# Altium project GoodProject.PrjPcb
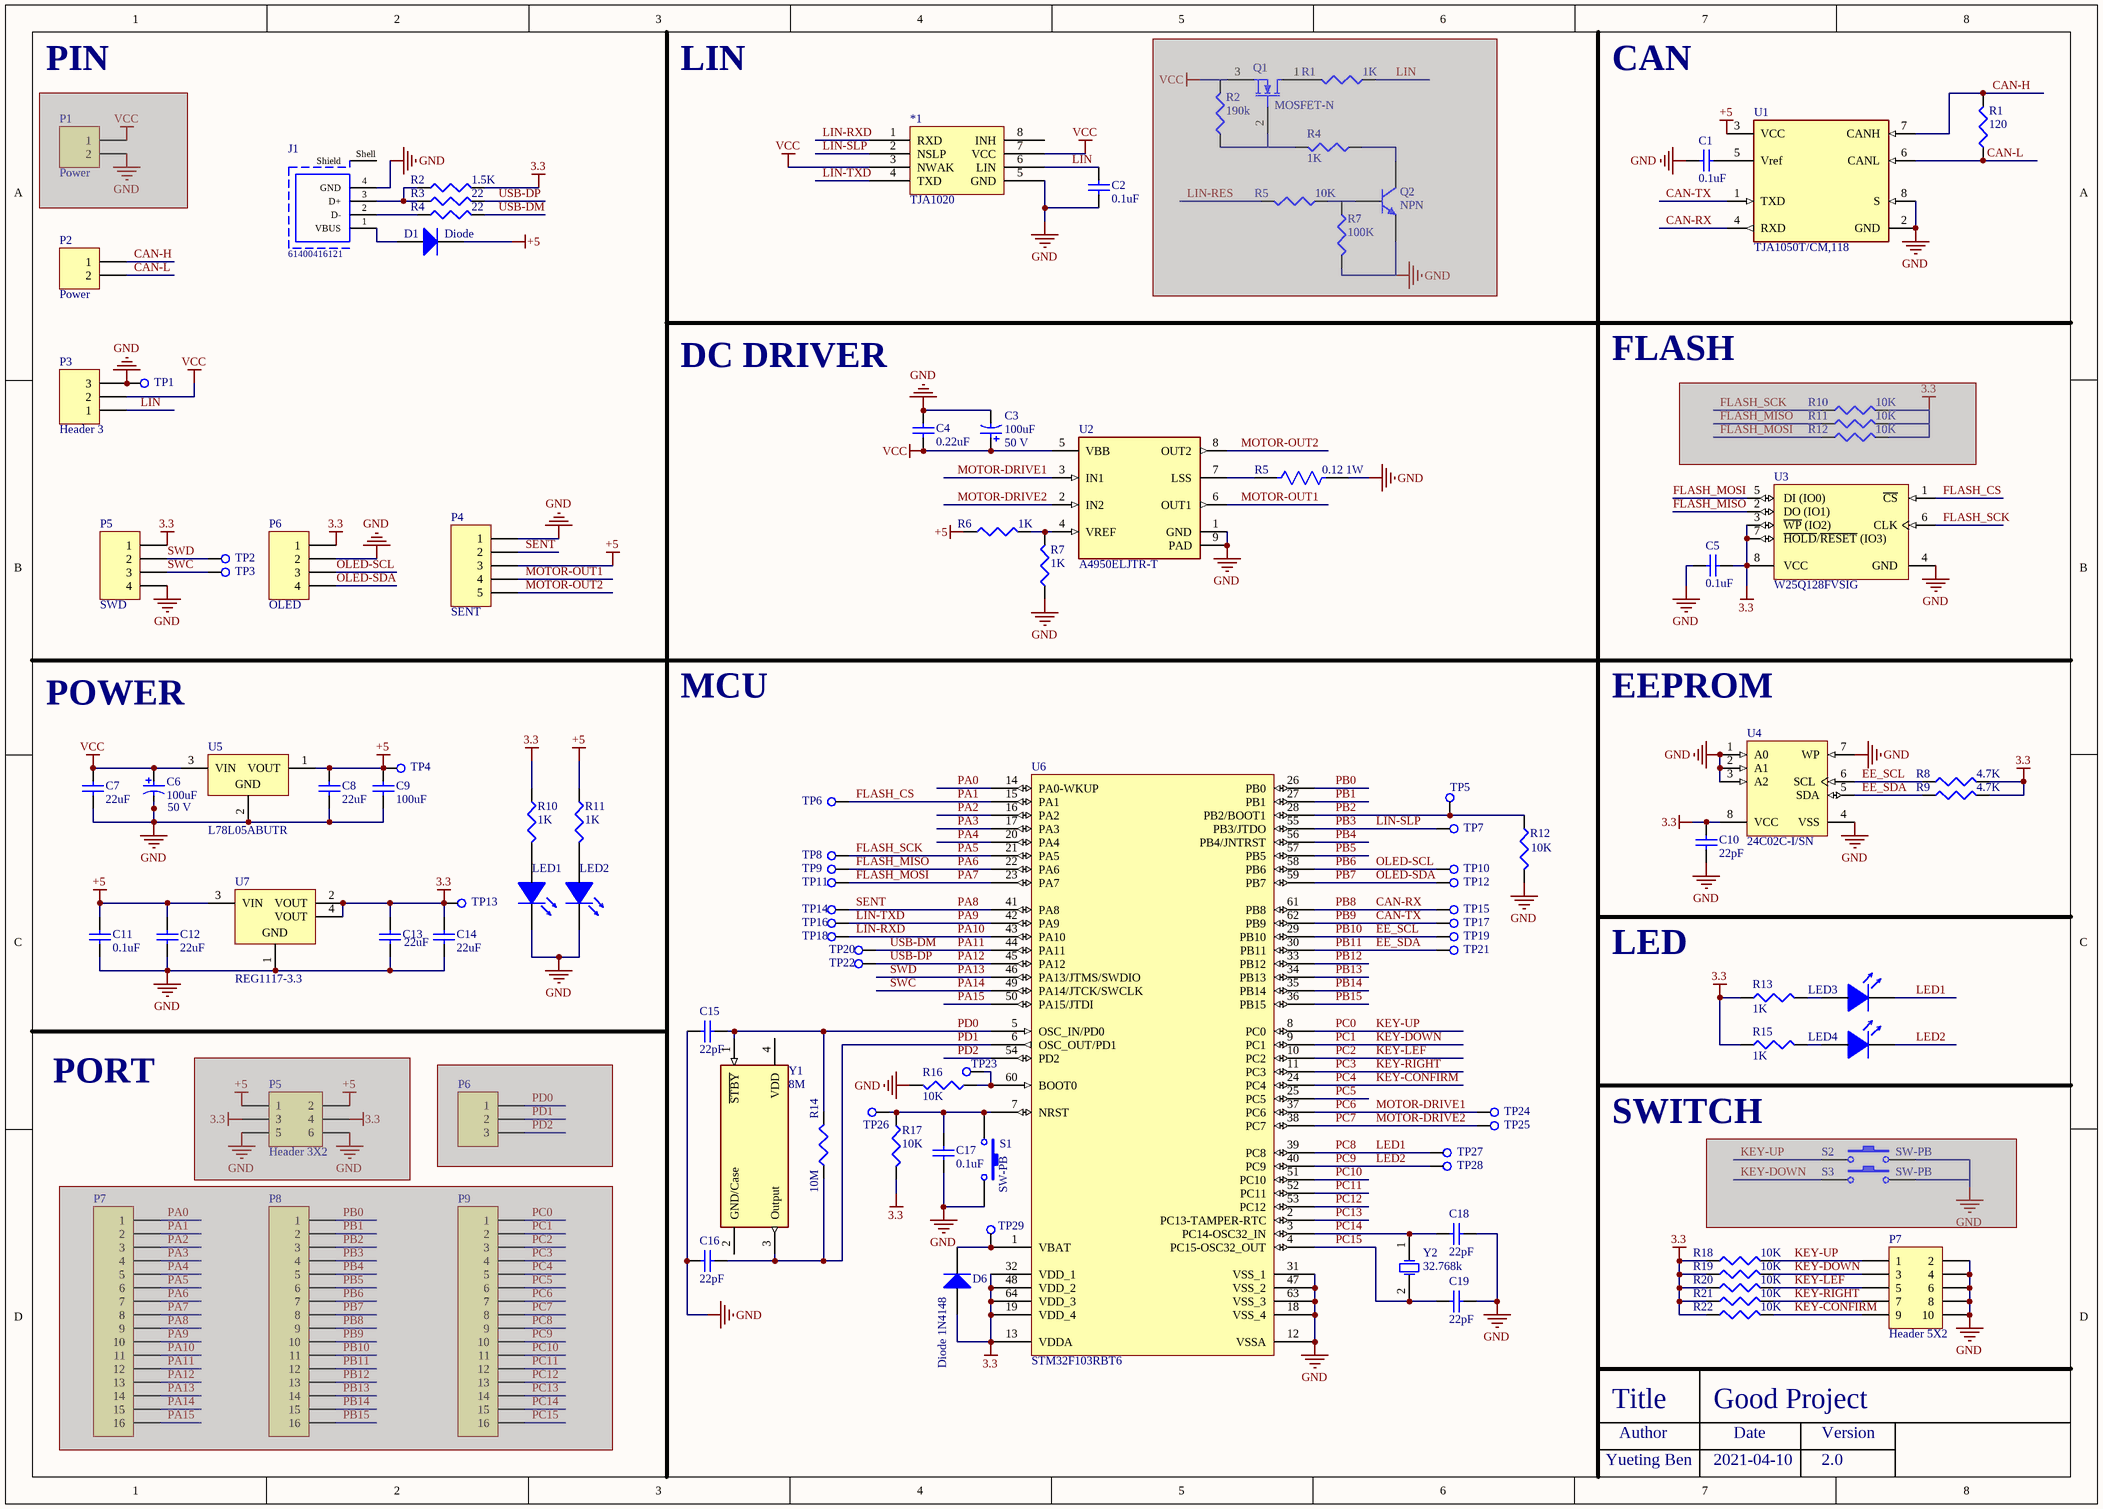
[diagram p0: GoodProject.SchDoc]
1 sheet, 112 parts. Net scope: global (net labels, ports and power ports of the same name join across sheets).
Board files: GoodProject_V1.0.PcbDoc, GoodProject_V2.0.PcbDoc

## Sheet GoodProject.SchDoc: Hello
size A3; Date: 2020-03-12; ApprovedBy: YuetingBen; Author: YuetingBen; Revision: 1.0; SheetNumber: 1; SheetTotal: 1

### Parts
(Parts that share a designator on the sheet are numbered #1, #2 ... from top to bottom, then left to right.)
*1  TJA1020  [SOP127P600X175-8N]
C1  value 0.1uF  [1608[0603]]  (hidden comment: Cap)
C2  value 0.1uF  [1608[0603]]  (hidden comment: Cap)
C3  100uF  Rated Voltage: 50 V  [NIC-CAPA2-6.3X5.8_V]
C4  value 0.22uF  [1608[0603]]  (hidden comment: Cap)
C5  value 0.1uF  [1608[0603]]  (hidden comment: Cap)
C6  100uF  Rated Voltage: 50 V  [NIC-CAPA2-6.3X5.8_V]
C7  value 22uF  [1608[0603]]  (hidden comment: Cap)
C8  value 22uF  [1608[0603]]  (hidden comment: Cap)
C9  value 100uF  [C1206]  (hidden comment: Cap)
C10  value 22pF  [1608[0603]]  (hidden comment: Cap)
C11  value 0.1uF  [1608[0603]]  (hidden comment: Cap)
C12  value 22uF  [1608[0603]]  (hidden comment: Cap)
C13  value 22uF  [1608[0603]]  (hidden comment: Cap)
C14  value 22uF  [C1206]  (hidden comment: Cap)
C15  value 22pF  [1608[0603]]  (hidden comment: Cap)
C16  value 22pF  [1608[0603]]  (hidden comment: Cap)
C17  value 0.1uF  [1608[0603]]  (hidden comment: Cap)
C18  value 22pF  [1608[0603]]  (hidden comment: Cap)
C19  value 22pF  [1608[0603]]  (hidden comment: Cap)
D1  Diode  [SMB]
D6  Diode 1N4148  [SMB]
J1  61400416121  [61400416121]
LED1  LED  [led3mm]  (value not drawn)
LED2  LED  [led3mm]  (value not drawn)
LED3  LED  [led3mm]  (value not drawn)
LED4  LED  [led3mm]  (value not drawn)
P1  Power  [PIN2]  (masked out: inside a compile mask, not in the netlist)
P2  Power  [PIN2]
P3  Header 3  [HDR1X3]
P4  SENT  [HDR1X5]
P5#1  SWD  [HDR1X4]
P5#2  Header 3X2  [HDR2X3]  (masked out: inside a compile mask, not in the netlist)
P6#1  OLED  [HDR1X4]
P6#2  Header 3  [HDR1X3]  (value not drawn)  (masked out: inside a compile mask, not in the netlist)
P7#1  Header 16  [HDR1X16]  (value not drawn)  (masked out: inside a compile mask, not in the netlist)
P7#2  Header 5X2  [HDR2X5]
P8  Header 16  [HDR1X16]  (value not drawn)  (masked out: inside a compile mask, not in the netlist)
P9  Header 16  [HDR1X16]  (value not drawn)  (masked out: inside a compile mask, not in the netlist)
Q1  MOSFET-N  [SOT23_N]  (masked out: inside a compile mask, not in the netlist)
Q2  NPN  [SOT23_N]  (masked out: inside a compile mask, not in the netlist)
R1#1  value 1K  [14-1210]  (hidden comment: Res3)  (masked out: inside a compile mask, not in the netlist)
R1#2  value 120  [J1-0603]  (hidden comment: Res3)
R2#1  value 190k  [J1-0603]  (hidden comment: Res3)  (masked out: inside a compile mask, not in the netlist)
R2#2  value 1.5K  [J1-0603]  (hidden comment: Res3)
R3  value 22  [J1-0603]  (hidden comment: Res3)
R4#1  value 1K  [J1-0603]  (hidden comment: Res3)  (masked out: inside a compile mask, not in the netlist)
R4#2  value 22  [J1-0603]  (hidden comment: Res3)
R5#1  value 10K  [J1-0603]  (hidden comment: Res3)  (masked out: inside a compile mask, not in the netlist)
R5#2  0.12 1W  [FP-CRCW2512-e3-IPC_C]
R6  value 1K  [J1-0603]  (hidden comment: Res3)
R7#1  value 100K  [J1-0603]  (hidden comment: Res3)  (masked out: inside a compile mask, not in the netlist)
R7#2  value 1K  [J1-0603]  (hidden comment: Res3)
R8  value 4.7K  [J1-0603]  (hidden comment: Res3)
R9  value 4.7K  [J1-0603]  (hidden comment: Res3)
R10#1  value 10K  [J1-0603]  (hidden comment: Res3)  (masked out: inside a compile mask, not in the netlist)
R10#2  value 1K  [J1-0603]  (hidden comment: Res3)
R11#1  value 10K  [J1-0603]  (hidden comment: Res3)  (masked out: inside a compile mask, not in the netlist)
R11#2  value 1K  [J1-0603]  (hidden comment: Res3)
R12#1  value 10K  [J1-0603]  (hidden comment: Res3)  (masked out: inside a compile mask, not in the netlist)
R12#2  value 10K  [J1-0603]  (hidden comment: Res3)
R13  value 1K  [J1-0603]  (hidden comment: Res3)
R14  value 10M  [J1-0603]  (hidden comment: Res3)
R15  value 1K  [J1-0603]  (hidden comment: Res3)
R16  value 10K  [J1-0603]  (hidden comment: Res3)
R17  value 10K  [J1-0603]  (hidden comment: Res3)
R18  value 10K  [J1-0603]  (hidden comment: Res3)
R19  value 10K  [J1-0603]  (hidden comment: Res3)
R20  value 10K  [J1-0603]  (hidden comment: Res3)
R21  value 10K  [J1-0603]  (hidden comment: Res3)
R22  value 10K  [J1-0603]  (hidden comment: Res3)
S1  SW-PB  [12Z-2010]
S2  SW-PB  [12Z-2010]  (masked out: inside a compile mask, not in the netlist)
S3  SW-PB  [12Z-2010]  (masked out: inside a compile mask, not in the netlist)
TP1  TestPoint*  [TestPoint]  (value not drawn)
TP2  TestPoint*  [TestPoint]  (value not drawn)
TP3  TestPoint*  [TestPoint]  (value not drawn)
TP4  TestPoint*  [TestPoint]  (value not drawn)
TP5  TestPoint*  [TestPoint]  (value not drawn)
TP6  TestPoint*  [TestPoint]  (value not drawn)
TP7  TestPoint*  [TestPoint]  (value not drawn)
TP8  TestPoint*  [TestPoint]  (value not drawn)
TP9  TestPoint*  [TestPoint]  (value not drawn)
TP10  TestPoint*  [TestPoint]  (value not drawn)
TP11  TestPoint*  [TestPoint]  (value not drawn)
TP12  TestPoint*  [TestPoint]  (value not drawn)
TP13  TestPoint*  [TestPoint]  (value not drawn)
TP14  TestPoint*  [TestPoint]  (value not drawn)
TP15  TestPoint*  [TestPoint]  (value not drawn)
TP16  TestPoint*  [TestPoint]  (value not drawn)
TP17  TestPoint*  [TestPoint]  (value not drawn)
TP18  TestPoint*  [TestPoint]  (value not drawn)
TP19  TestPoint*  [TestPoint]  (value not drawn)
TP20  TestPoint*  [TestPoint]  (value not drawn)
TP21  TestPoint*  [TestPoint]  (value not drawn)
TP22  TestPoint*  [TestPoint]  (value not drawn)
TP23  TestPoint*  [TestPoint]  (value not drawn)
TP24  TestPoint*  [TestPoint]  (value not drawn)
TP25  TestPoint*  [TestPoint]  (value not drawn)
TP26  TestPoint*  [TestPoint]  (value not drawn)
TP27  TestPoint*  [TestPoint]  (value not drawn)
TP28  TestPoint*  [TestPoint]  (value not drawn)
TP29  TestPoint*  [TestPoint]  (value not drawn)
U1  TJA1050T/CM,118  [FP-SOT96-1-IPC_A]
U2  A4950ELJTR-T  [FP-LJ-8-MFG]
U3  W25Q128FVSIG  [WINB-SOIC-8_M]
U4  24C02C-I/SN  [SOIC-SN8_L]
U5  L78L05ABUTR  [SOT-89_N]
U6  STM32F103RBT6  [LQFP64_N]
U7  REG1117-3.3  [DCY0004A_M]
Y1  8M  [FP-ASE-MFG]
Y2  32.768k  [C1206]

### Nets
3.3: C5.1 C10.2 C13.2 C14.2 D6.1(A) P5#1.1 P6#1.1 R2#2.2 R8.2 R9.2 R10#2.1 R13.1 R15.1 R17.2 R18.1 R19.1 R20.1 R21.1 R22.1 TP13.1 U3.3(~{WP}_(IO2)) U3.7(~{HOLD}/~{RESET}_(IO3)) U3.8(VCC) U4.8(VCC) U6.13(VDDA) U6.19(VDD_4) U6.32(VDD_1) U6.48(VDD_2) U6.64(VDD_3) U7.2(VOUT) U7.4(VOUT)
+5: C8.2 C9.2 C11.2 C12.2 D1.2(K) P4.3 R6.1 R11#2.1 TP4.1 U1.3(VCC) U5.1(VOUT) U7.3(VIN)
GND: *1.5(GND) C1.2 C2.1 C3.2 C4.1 C5.2 C6.2 C7.1 C8.1 C9.1 C10.1 C11.1 C12.1 C13.1 C14.1 C15.2 C16.2 C17.1 C18.1 C19.1 J1.4(GND) LED1.2 LED2.2 P3.3 P4.1 P5#1.4 P6#1.2 P7#2.2 P7#2.4 P7#2.6 P7#2.8 P7#2.10 R5#2.2 R7#2.1 R12#2.2 R16.2 S1.2 TP1.1 U1.2(GND) U1.8(S) U2.1(GND) U2.9(PAD) U3.4(GND) U4.1(A0) U4.2(A1) U4.3(A2) U4.4(VSS) U4.7(WP) U5.2(GND) U6.12(VSSA) U6.18(VSS_4) U6.31(VSS_1) U6.47(VSS_2) U6.63(VSS_3) U7.1(GND)
VCC: *1.3(NWAK) *1.7(VCC) C3.1 C4.2 C6.1 C7.2 P3.2 U2.5(VBB) U5.3(VIN)
CAN-H: P2.1 R1#2.2 U1.7(CANH)
CAN-L: P2.2 R1#2.1 U1.6(CANL)
CAN-RX: TP15.1 U1.4(RXD) U6.61(PB8)  [also labelled PB8]
CAN-TX: TP17.1 U1.1(TXD) U6.62(PB9)  [also labelled PB9]
EE_SCL: R8.1 TP19.1 U4.6(SCL) U6.29(PB10)  [also labelled PB10]
EE_SDA: R9.1 TP21.1 U4.5(SDA) U6.30(PB11)  [also labelled PB11]
FLASH_CS: TP6.1 U3.1(~{CS}) U6.15(PA1)  [also labelled PA1]
FLASH_MISO: TP9.1 U3.2(DO_(IO1)) U6.22(PA6)  [also labelled PA6]
FLASH_MOSI: TP11.1 U3.5(DI_(IO0)) U6.23(PA7)  [also labelled PA7]
FLASH_SCK: TP8.1 U3.6(CLK) U6.21(PA5)  [also labelled PA5]
KEY-CONFIRM: P7#2.9 R22.2 U6.24(PC4)  [also labelled PC4]
KEY-DOWN: P7#2.3 R19.2 U6.9(PC1)  [also labelled PC1]
KEY-LEF: P7#2.5 R20.2 U6.10(PC2)  [also labelled PC2]
KEY-RIGHT: P7#2.7 R21.2 U6.11(PC3)  [also labelled PC3]
KEY-UP: P7#2.1 R18.2 U6.8(PC0)  [also labelled PC0]
LED1: LED3.2 TP27.1 U6.39(PC8)  [also labelled PC8]
LED2: LED4.2 TP28.1 U6.40(PC9)  [also labelled PC9]
LIN: *1.6(LIN) C2.2 P3.1
LIN-RXD: *1.1(RXD) TP18.1 U6.43(PA10)  [also labelled PA10]
LIN-SLP: *1.2(NSLP) TP7.1 U6.55(PB3/JTDO)  [also labelled PB3]
LIN-TXD: *1.4(TXD) TP16.1 U6.42(PA9)  [also labelled PA9]
MOTOR-DRIVE1: TP24.1 U2.3(IN1) U6.37(PC6)  [also labelled PC6]
MOTOR-DRIVE2: TP25.1 U2.2(IN2) U6.38(PC7)  [also labelled PC7]
MOTOR-OUT1: P4.4 U2.6(OUT1)
MOTOR-OUT2: P4.5 U2.8(OUT2)
OLED-SCL: P6#1.3 TP10.1 U6.58(PB6)  [also labelled PB6]
OLED-SDA: P6#1.4 TP12.1 U6.59(PB7)  [also labelled PB7]
PA0: U6.14(PA0-WKUP)
PA2: U6.16(PA2)
PA3: U6.17(PA3)
PA4: U6.20(PA4)
PA8: P4.2 TP14.1 U6.41(PA8)  [also labelled SENT]
PA11: R4#2.2 TP20.1 U6.44(PA11)  [also labelled USB-DM]
PA12: R3.2 TP22.1 U6.45(PA12)  [also labelled USB-DP]
PA13: P5#1.2 TP2.1 U6.46(PA13/JTMS/SWDIO)  [also labelled SWD]
PA14: P5#1.3 TP3.1 U6.49(PA14/JTCK/SWCLK)  [also labelled SWC]
PA15: U6.50(PA15/JTDI)
PB0: U6.26(PB0)
PB1: U6.27(PB1)
PB2: R12#2.1 TP5.1 U6.28(PB2/BOOT1)
PB4: U6.56(PB4/JNTRST)
PB5: U6.57(PB5)
PB12: U6.33(PB12)
PB13: U6.34(PB13)
PB14: U6.35(PB14)
PB15: U6.36(PB15)
PC5: U6.25(PC5)
PC10: U6.51(PC10)
PC11: U6.52(PC11)
PC12: U6.53(PC12)
PC13: U6.2(PC13-TAMPER-RTC)
PC14: C18.2 U6.3(PC14-OSC32_IN) Y2.1(OSC1)
PC15: C19.2 U6.4(PC15-OSC32_OUT) Y2.2(OSC2)
PD0: C15.1 R14.2 U6.5(OSC_IN/PD0) Y1.1(~{STBY})
PD1: C16.1 R14.1 U6.6(OSC_OUT/PD1) Y1.3(Output)
PD2: U6.54(PD2)
NetC1_1: C1.1 U1.5(Vref)
NetC17_2: C17.2 R17.1 S1.1 TP26.1 U6.7(NRST)
NetD1_1: D1.1(A) J1.1(VBUS)
NetD6_2: D6.2(K) TP29.1 U6.1(VBAT)
NetJ1_2: J1.2(D-) R4#2.1
NetJ1_3: J1.3(D+) R2#2.1 R3.1
NetLED1_1: LED1.1 R10#2.2
NetLED2_1: LED2.1 R11#2.2
NetLED3_1: LED3.1 R13.2
NetLED4_1: LED4.1 R15.2
NetR5#2_1: R5#2.1 U2.7(LSS)
NetR6_2: R6.2 R7#2.2 U2.4(VREF)
NetR16_1: R16.1 TP23.1 U6.60(BOOT0)

Not connected (* = marked no-connect by the designer): *1 8(INH); J1 Shell(Shield); Y1 2(GND/Case) 4(VDD)

### Notes on the sheet
- PIN
- LIN
- CAN
- DC DRIVER
- FLASH
- POWER
- MCU
- (near U4) EEPROM
- LED
- PORT
- SWITCH
- Title
- Author
- Good Project
- Date
- Version
- Yueting Ben
- 2021-04-10
- 2.0

### Library data of the parts
C1 C2 C4 C5 C7-C19 = Cap: Capacitor; Published: 8-Jun-2000; LatestRevisionDate: 17-Jul-2002; LatestRevisionNote: Re-released for DXP Platform.; PackageReference: RAD-0.3; Publisher: Altium Limited; PackageDescription: Radial Cap, Thru-Hole; 2 Leads; 0.3 in Pin Spacing
C3 C6 = CMP-0687-00035-1: Aluminum Electrolytic Capacitor, UD Series, Low Impedance, 68 uF, 16 V, + / - 20%, -55 to 105 degC, Chip Type, 6.3 x 5.8 mm D x L, Pb-Free, Reel; PartNumber: UUD1C680MCL1GS; Manufacturer: Nichicon; Endurance Time: 2000 h; Rated Ripple Current (at 100kHz): 230 mA; Rated Capacitance: 68 uF; Impedance: 0.44 Ohm; Packing: Dia382mm Reel; Tolerance Rated Capacitance: -20 to 20%; ComponentLink2URL: http://products.nichicon.co.jp/en/pdf/XJA043/e-ud.pdf; RoHS: TRUE; ComponentLink2Description: Datasheet; ComponentLink1Description: Manufacturer URL; PackageReference: CAPAE-D6.3H5.8; ComponentLink1URL: http://www.nichicon.co.jp/; ComponentLink3URL: http://products.nichicon.co.jp/en/pdf/XJA043/e-ud.pdf; ComponentLink3Description: Package Specification; Length: 5.8 mm; DatasheetVersion: 08/2012; PackageDescription: 2-Pin Surface Mount Device, Diameter 6.3 mm, Height 5.8 mm, Pitch 5.4 mm; Diameter: 6.3 mm; Mounting Technology: Surface Mount
D1 = Diode: Default Diode; Published: 8-Jun-2000; LatestRevisionDate: 17-Jul-2002; LatestRevisionNote: Re-released for DXP Platform.; PackageVersion: Sep-1996; PackageReference: SMC; Publisher: Altium Limited; PackageDescription: DO-214-AB/SMC; 2 C-Bend Leads; Body 7.9 x 5.9 mm, inc. leads (LxW); Code_JEDEC: DO-214-AB
D6 = Diode 1N4148: High Conductance Fast Diode; Published: 8-Jun-2000; LatestRevisionDate: 17-Jul-2002; LatestRevisionNote: Re-released for DXP Platform.; DatasheetVersion: 1997; PackageReference: DO-35; Publisher: Altium Limited; PackageDescription: Diode, Axial; Body 3.8 x 1.9 mm (LxDia. max), Lead Dia. 0.53 mm (max); Code_JEDEC: DO-204-AH; ComponentLink1Description: Manufacturer Link; ComponentLink1URL: http://www.fairchildsemi.com/; ComponentLink2Description: Datasheet; ComponentLink2URL: http://www.fairchildsemi.com/ds/1N%2F1N4148.pdf
J1 = CMP-1502-03243-1: USB 2.0 Type B Receptacle WR-COM, Horizontal, THT, with Pads and Pegs; Manufacturer: Wurth Elektronik; Contact Resistance: 20mOhm; Rated Current: 1.5A; Working Voltage: 30VAC; Package Reference: 61400416121; Part Number: 61400416121; Packaging: Tray; Mounting Technology: THT; Gender: Receptacle; Datasheet URL: https://katalog.we-online.de/em/datasheet/61400416121.pdf; Publisher: WurthElektronik; Orientation: Horizontal; Connector Type: USB2.0TypeB; Operating Temperature: -40to105degC; Manufacturer URL: http://www.we-online.de
P1 P2 = Header 2H: Header, 2-Pin, Right Angle; LatestRevisionDate: 17-Jul-2002; LatestRevisionNote: Re-released for DXP Platform.; Publisher: Altium Limited
P3 P6#2 = Header 3: Header, 3-Pin; LatestRevisionDate: 17-Jul-2002; LatestRevisionNote: Re-released for DXP Platform.; Publisher: Altium Limited
P4 = Header 5: Header, 5-Pin; LatestRevisionDate: 17-Jul-2002; LatestRevisionNote: Re-released for DXP Platform.; Publisher: Altium Limited
P5#1 P6#1 = Header 4: Header, 4-Pin; LatestRevisionDate: 17-Jul-2002; LatestRevisionNote: Re-released for DXP Platform.; Publisher: Altium Limited
P5#2 = Header 3X2: Header, 3-Pin, Dual row; LatestRevisionDate: 17-Jul-2002; LatestRevisionNote: Re-released for DXP Platform.; Publisher: Altium Limited
P7#1 P8 P9 = Header 16: Header, 16-Pin; LatestRevisionDate: 17-Jul-2002; LatestRevisionNote: Re-released for DXP Platform.; Publisher: Altium Limited
P7#2 = Header 5X2: Header, 5-Pin, Dual row; LatestRevisionDate: 17-Jul-2002; LatestRevisionNote: Re-released for DXP Platform.; Publisher: Altium Limited
Q1 = MOSFET-N: N-Channel MOSFET; Published: 8-Jun-2000; LatestRevisionDate: 17-Jul-2002; LatestRevisionNote: Re-released for DXP Platform.; PackageVersion: 1995/1996; PackageReference: E3; Publisher: Altium Limited; PackageDescription: TO, Flat Index; 3 In-Line, Axial Leads; Body Dia. 4.6mm; Lead Dia. 0.5 mm (max)
Q2 = NPN: NPN Bipolar Transistor; Published: 8-Jun-2000; LatestRevisionDate: 17-Jul-2002; LatestRevisionNote: Re-released for DXP Platform.; PackageReference: TO-226-AA; Publisher: Altium Limited; PackageDescription: TO, Flat Index; 3 In-Line, Axial Leads; Body Dia. 4.8mm; Leads 0.55 x 0.51 mm (max); Code_JEDEC: TO-226-AA
R1#1 R1#2 R2#1 R2#2 R3 R4#1 R4#2 R5#1 R6 R7#1 R7#2 R8 R9 R10#1 R10#2 R11#1 R11#2 R12#1 R12#2 R13-R22 = Res3: Resistor; Published: 8-Jun-2000; LatestRevisionDate: 29-May-2009; LatestRevisionNote: IPC-7351 Footprint Added.; PackageReference: J1-0603; Publisher: Altium Limited; PackageDescription: Chip Resistor
R5#2 = CMP-02407-006956-1: RES Thick Film, 1Ω, 1%, 1W, 100ppm/°C, 2512; Resistance: 1R; Voltage Rating: 500V; Number of Terminations: 2; Packaging: Tape and Reel; Features: Automotive AEC-Q200; Military Standard: Not; Power Rating: 1W; Max Operating Temperature: 155°C; Number of Pins: 2; Radiation Hardening: No; Mount: Surface Mount; Height: 0.6mm; Max Power Dissipation: 1W; Case Code (Metric): 6432; Termination: SMD/SMT; REACH SVHC: No SVHC; Case/Package: 2512; Weight: 0.001429oz; Tolerance: 1%; Package Quantity: 2000; Composition: Thick Film; Temperature Coefficient: 100ppm/°C; Voltage Rating (DC): 500V; Width: 0.124inch; Length: 6.3mm; Lead Free: Lead Free; Min Operating Temperature: -55°C; Contact Plating: Tin; Case Code (Imperial): 2512; Depth: 3.15mm
S1-S3 = SW-PB: Switch; Published: 24-Mar-1999; LatestRevisionDate: 17-Jul-2002; LatestRevisionNote: Re-released for DXP Platform.; PackageReference: SPST-2; Publisher: Altium Limited; PackageDescription: Switch; 2 Leads
TP1-TP29 = TP
U1 = CMP-2000-04923-2: IC TRANSCEIVER HALF 1/1 8SO; Simplex/Duplex: Half Duplex; Max Supply Current: 10mA; Number of Receive Buffers: 1; Min Supply Voltage: 4.75V; Max Supply Voltage: 5.25V; Interface: CAN; Data Rate: 1Mbps; Receiver Hysteresis: 70mV; Number of Transmit Buffers: 1; Min Operating Temperature: -40°C; Case/Package: SO; REACH SVHC: No SVHC; Max Operating Temperature: 150°C; Number of Pins: 8; Lead Free: Lead Free; Number of Transceivers: 1; Packaging: Tape and Reel; Mount: Surface Mount; Radiation Hardening: No; Nominal Supply Current: 10mA; Package Quantity: 2500; Contact Plating: Gold
U2 = CMP-82903-000003-1: IC MOTOR DRIVER 8V-40V 8SOIC; Output Current: 3.5A; Number of Outputs: 1; Min Supply Voltage: 8V; Collector Emitter Voltage (VCEO): 40V; Motor Type: Brushed; Number of Pins: 8; Case/Package: SOIC; Height: 1.55mm; Package Quantity: 1; Mount: Surface Mount; Max Operating Temperature: 85°C; Min Operating Temperature: -40°C; REACH SVHC: No SVHC; Radiation Hardening: No; Length: 4.9mm; Packaging: Tape and Reel; Lead Free: Lead Free; Max Collector Current: 3.5A; Width: 3.9mm; Max Supply Voltage: 40V; Output Voltage: 40V
U3 = CMP-2000-05005-1: 3V 128M-Bit Serial Flash Memory with Dual/Quad SPI & QPI, 2.7 to 3.6 V, -40 to 85 degC, 8-Pin SOIC, RoHS, Tape and Reel; Manufacturer: Winbond; Number of Words: 16777216; Address Bus: 24b; Word Size: 8b; Boot Type: NotRequired; Supply Current: 20mA; Operating Supply Voltage (Max): 3.6V; Sync/Async: Synchronous; Rad Hardened: No; Interface Type: Serial(SPI); Access Time (Max): 7ns; Operating Supply Voltage (Min): 2.7V; Operating Supply Voltage (Typ): 3/3.3V; Programmable: Yes; Density: 134217728Bit; Cell Type: NOR; Package Description: 8-Pin Small Outline Integrated Circuit, Body 5.28 x 5.28 mm, Pitch 1.27 mm; Datasheet URL: http://download.siliconexpert.com/pdfs/2015/11/30/6/42/17/890/win_/manual/3w25q128fv20rev.l2008242015.pdf; Package Reference: SS-8; Package Type: SOICW; Datasheet Version: Rev. L, 08/2015; Manufacturer URL: http://www.winbond.com/hq/index.html?__locale=en; Pin Count: 8; Operating Temperature Classification: Industrial; Operating Temperature (Min): -40C; Program/Erase Volt (Typ): 2.7to3.6V; Operating Temperature (Max): 85C; Mounting: SurfaceMount; Operating Temp Range: -40Cto85C
U4 = CMP-0159-00277-1: 2Kbit, 400kHz, 5V, I2C Serial EEPROM, 8-Pin SOIC 150mil, Industrial Temperature; Code_JEDEC: MS-012; DatasheetVersion: revJ, Aug-2008; PackageVersion: revBB, Aug-2009; Code_IPC: SOIC127P600-8; PackageDescription: 8-Lead Plastic Small Outline (SN) - Narrow, 3.90mm Body [SOIC]; PackageReference: SOIC-SN8
U5 = CMP-0244-00406-1: Positive Voltage Regulator, 5V, 4-Pin SOT-89, Tape and Reel; PackageVersion: 2011; DatasheetVersion: 1/02/2011; PackageDescription: 3-Pin SOT-89 Package 1.5 mm Pitch, 4.1 mm Lead Span; PackageReference: SOT-89; ComponentLink2Description: Datasheet; ComponentLink1URL: http://www.st.com; ComponentLink1Description: Manufacturer URL; ComponentLink2URL: http://www.st.com/internet/com/TECHNICAL_RESOURCES/TECHNICAL_LITERATURE/DATASHEET/CD00000446.pdf
U6 = STM32F103RBT6: STM32 ARM-based 32-bit MCU with 128 Kbytes Flash, 64-pin LQFP, Industrial Temperature; Published: 30-May-2008; DatasheetVersion: rev6, Mar-2008; PackageVersion: Mar-2008; PackageReference: LQFP64; Publisher: Altium Limited; PackageDescription: 64-Pin Low-Profile Quad Flat Pack, 10 x 10 mm Body, 0.5 mm Pitch (LQFP64); ComponentLink1Description: Manufacturer Link; ComponentLink1URL: www.st.com/stm32; ComponentLink2Description: Datasheet; ComponentLink2URL: http://www.st.com/stonline/products/literature/ds/13587.pdf
U7 = CMP-0395-00549-2: Single Output LDO, 800 mA, Fixed 3.3 V Output, 3.8 to 15 V Input, with Internal Current Limiting, 4-pin SOT-223 (DCY), -40 to 125 degC, Green (RoHS & no Sb/Br); Manufacturer: Texas Instruments; Vout Adj(Max)(V): 3.3; Vin(Max)(V): 15; Iq(Typ)(mA): 4; Iout(Max)(A): 0.8; Vdo(Typ)(mV): 1100; Vin(Min)(V): 3.8; SubFamily: Single Channel LDO; Rating: Catalog; Fixed Output Options(V): 5; ComponentLink1Description: Manufacturer URL; Eco-Plan: Green (RoHS & no Sb/Br); PackageReference: DCY0004A; Mounting Technology: Surface Mount; ComponentLink3Description: Package Specification; Vout Adj(Min)(V): 3.3; ComponentLink2URL: http://www.ti.com/general/docs/lit/getliterature.tsp?genericPartNumber=REG1117-33&fileType=pdf; PackageVersion: 4202506/B; ComponentLink3URL: http://www.ti.com/litv/pdf/mpds094a; Code_JEDEC: TO-261; ComponentLink1URL: http://www.ti.com/; ComponentLink2Description: Datasheet; PartNumber: REG1117-3.3; DatasheetVersion: SBVS001D; PackageDescription: 4-Pin Plastic Small Outline, Body 3.5 x 6.5 mm, Pitch 2.3 mm
Y1 = CMP-27762-010648-1: XTAL Oscillator 33.333MHz ±50ppm CMOS 3.3V 4-SMD 3.2mm x 2.5mm; Max Supply Voltage: 3.465V; Load Capacitance: 15pF; Min Supply Voltage: 3.135V; Max Supply Current: 13mA; Package Quantity: 1000; Frequency: 33.333MHz; Radiation Hardening: No; Case/Package: SMD/SMT; REACH SVHC: No SVHC; Max Operating Temperature: 85°C; Operating Supply Voltage: 3.3V; Depth: 2.5mm; Height: 0.047inch; Mount: Surface Mount; Lead Free: Lead Free; Width: 0.098inch; Packaging: Tape and Reel; Operating Frequency: 33.333 MHz; Series: ASE; Termination: SMD/SMT; Min Operating Temperature: -40°C; Frequency Stability: 50ppm; Number of Pins: 4; Length: 3.2mm
Y2 = XTAL: Crystal Oscillator; Published: 8-Jun-2000; LatestRevisionDate: 17-Jul-2002; LatestRevisionNote: Re-released for DXP Platform.; PackageReference: R38; Publisher: Altium Limited; PackageDescription: Crystal, Thru-Hole; 2 Leads; Body 3.1 x 8.2 mm (Dia.xH)